# Altium schematic sheet [01] - COVER PAGE.SchDoc: DOCUMENT TITLE
size A4; Organization: Bjørn T. Brodtkorb; Address1: Frode Rinnans veg 161; Address2: 7050 Trondheim; DocumentNumber: 6598; Revision: 1.0; SheetNumber: 1; SheetTotal: 1
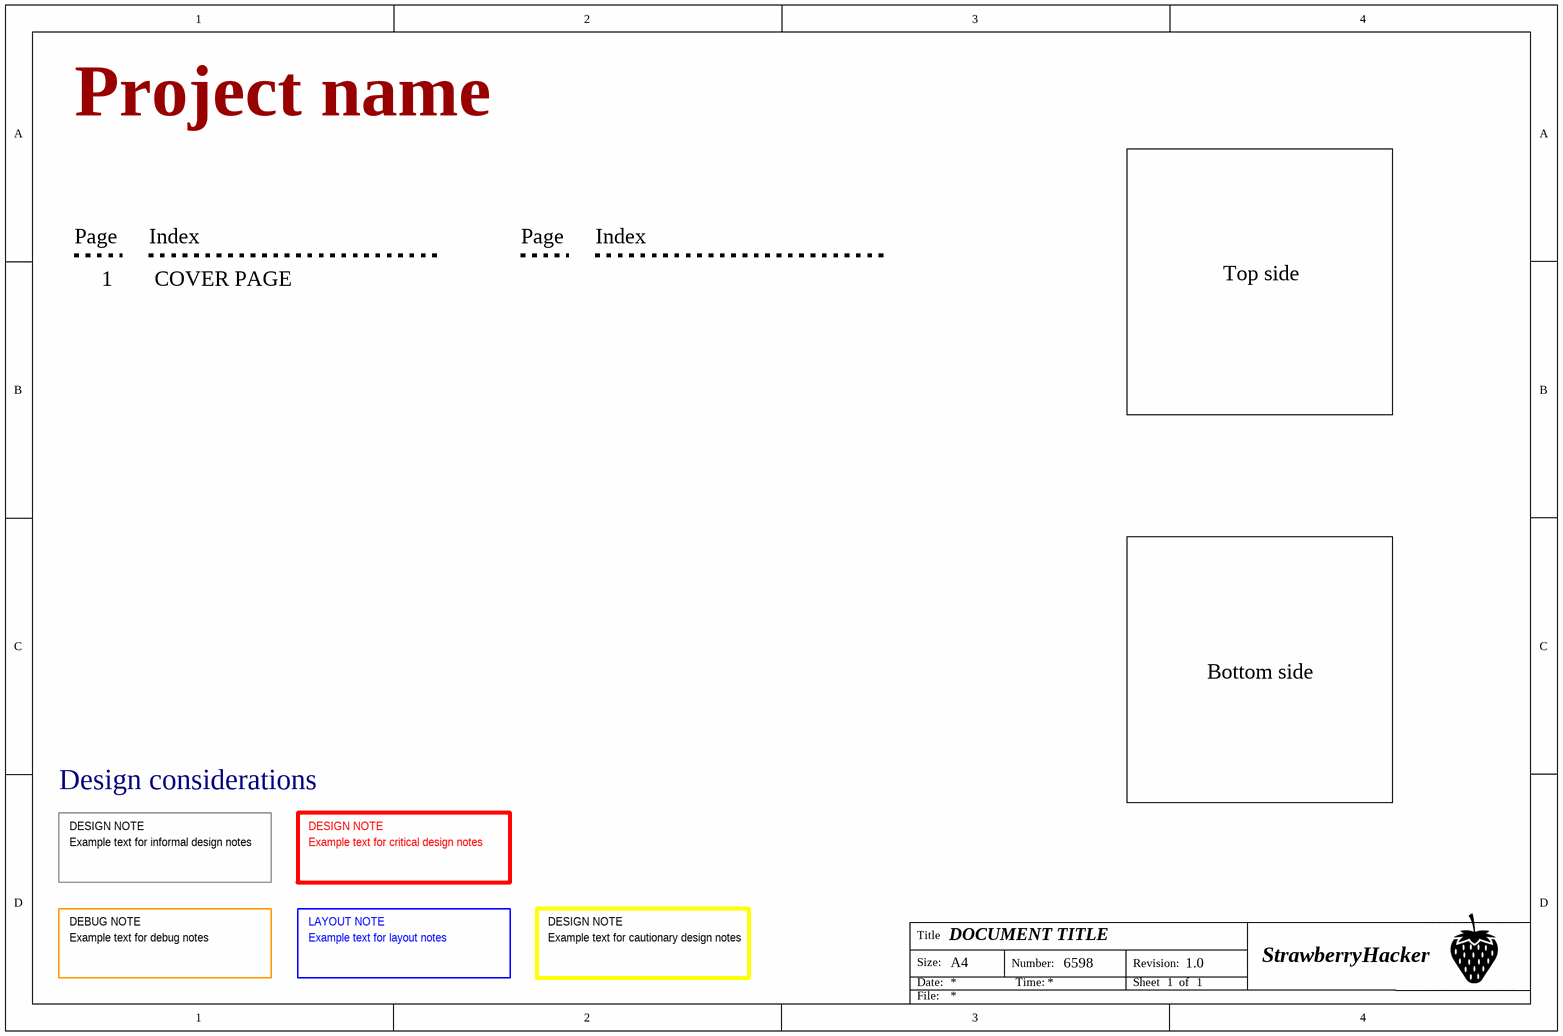
[diagram p0: [01] - COVER PAGE.SchDoc]

## Notes on the sheet
- Project name
- Page
- Index
- 1
- COVER PAGE
- Top side
- Bottom side
- Design considerations
- DESIGN NOTE
- Example text for informal design notes
- Example text for critical design notes
- DEBUG NOTE
- Example text for debug notes
- LAYOUT NOTE
- Example text for layout notes
- Example text for cautionary design notes
- Title
- Size:
- Date:
- A4
- Number:
- Time:
- Revision:
- Sheet
- of
- StrawberryHacker
- File: